# EAGLE schematic class a (EAGLE 9.6.2)
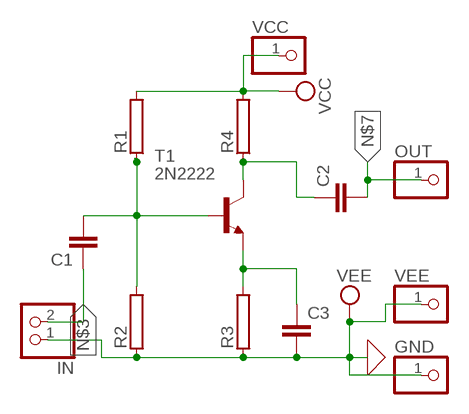
[diagram p0: schematic, sheet 1]

## Parts
C1  C2,5-3  [C2.5-3]
C2  C2,5-3  [C2.5-3]
C3  C2,5-3  [C2.5-3]
GND  PINHD-1X1  [1X01]
IN  PINHD-1X2  [1X02]
OUT  PINHD-1X1  [1X01]
R1  RAC01  [AC01]
R2  RAC01  [AC01]
R3  RAC01  [AC01]
R4  RAC01  [AC01]
T1  2N2222  [TO18]
VCC  PINHD-1X1  [1X01]
VEE  PINHD-1X1  [1X01]

## Nets
N$1: C1.2 R1.1 R2.2 T1.2(B)
N$2: C2.1 R4.1 T1.3(C)
N$3: C1.1 IN.2
N$5: C3.1 R3.2 T1.1(E)
N$7: C2.2 OUT.1
VCC: R1.2 R4.2 VCC.1
VEE: C3.2 GND.1 IN.1 R2.1 R3.1 VEE.1 ; supply symbol labelled GND

## Library data of the parts
C1-C3 = capacitor-wima:C: CAPACITOR naming: grid - package width
GND OUT VCC VEE = pinhead:PINHD-1X1: PIN HEADER
IN = pinhead:PINHD-1X2: PIN HEADER
R1-R4 = resistor-power:R: Power Resitor; OC_FARNELL: unknown; OC_NEWARK: unknown
T1 = transistor:2N2222: NPN TRANSISTOR